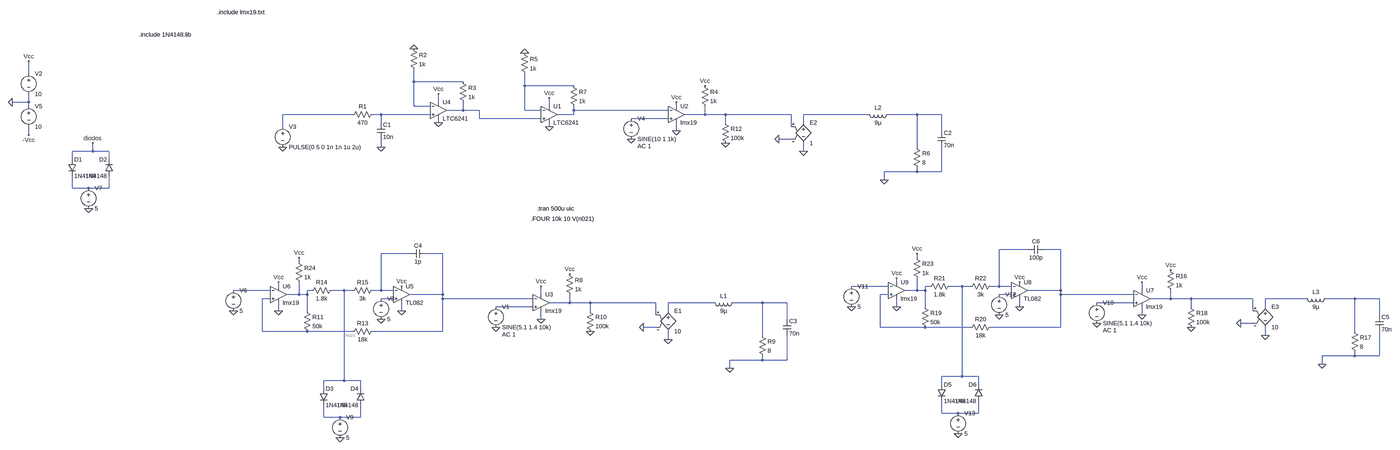
[diagram p0: schematic Entradas_varias_smith_Triger.asc, whole sheet]
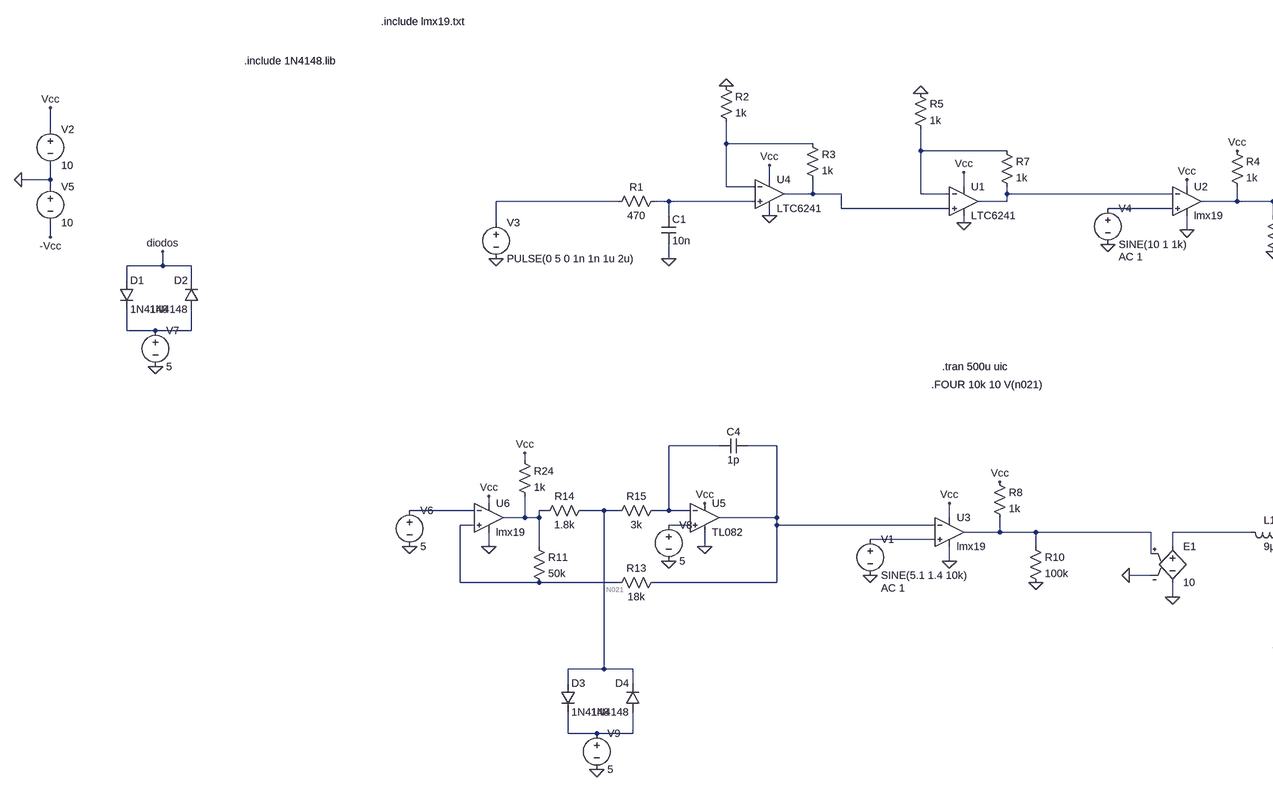
[diagram p1: schematic Entradas_varias_smith_Triger.asc, part, row 1 of 1, column 1 of 2]
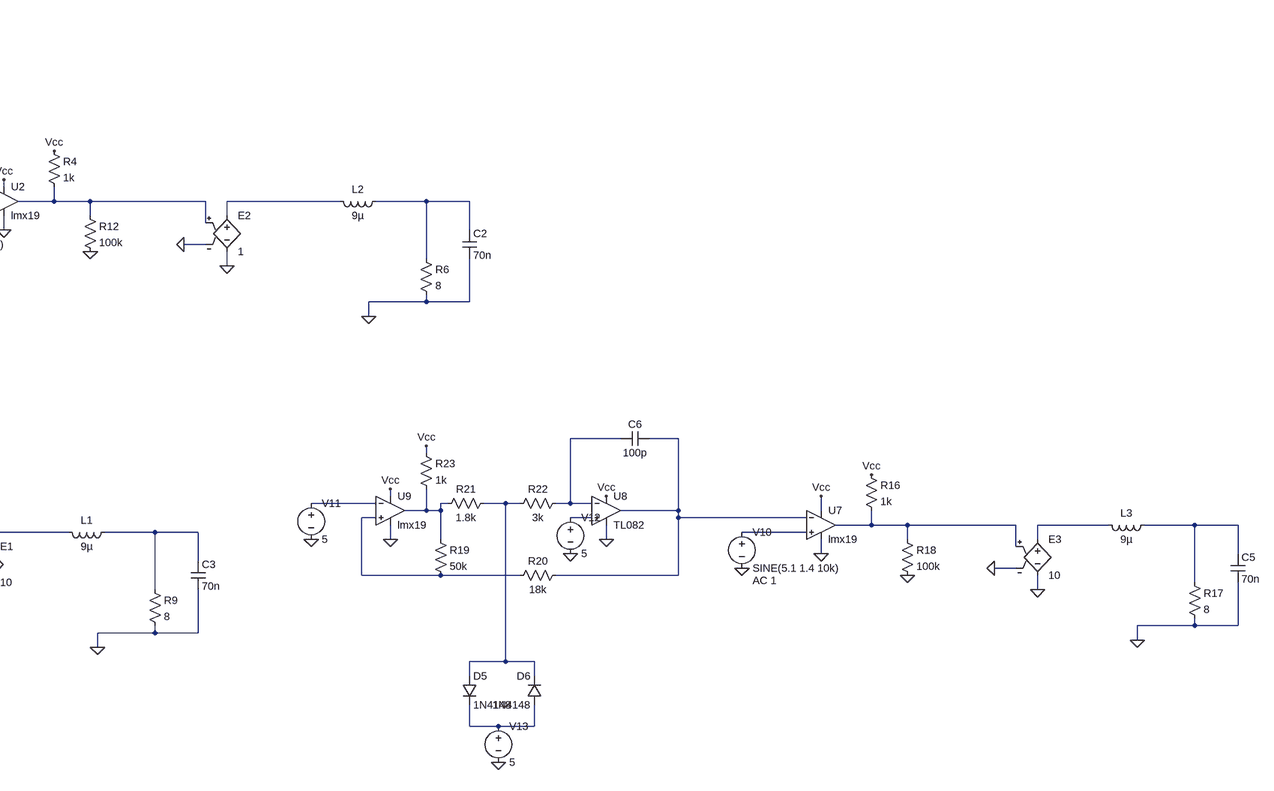
[diagram p2: schematic Entradas_varias_smith_Triger.asc, part, row 1 of 1, column 2 of 2]
Entradas_varias_smith_Triger.asc, the LTspice schematic file:
Version 4
SHEET 1 5240 2308
WIRE -544 176 -544 128
WIRE 1312 208 1312 160
WIRE 1504 208 1312 208
WIRE 1744 224 1744 176
WIRE 1936 224 1744 224
WIRE -544 288 -544 256
WIRE -544 288 -608 288
WIRE 1408 288 1408 256
WIRE -544 304 -544 288
WIRE 1312 304 1312 208
WIRE 1376 304 1312 304
WIRE 1840 304 1840 272
WIRE 2336 304 2336 288
WIRE 1504 320 1504 288
WIRE 1504 320 1440 320
WIRE 1568 320 1504 320
WIRE 1744 320 1744 224
WIRE 1808 320 1744 320
WIRE 1936 320 1936 304
WIRE 2304 320 1936 320
WIRE 1072 336 800 336
WIRE 1184 336 1152 336
WIRE 1376 336 1184 336
WIRE 1936 336 1936 320
WIRE 1936 336 1872 336
WIRE 2448 336 2448 304
WIRE 2448 336 2368 336
WIRE 2528 336 2448 336
WIRE 2784 336 2528 336
WIRE 3088 336 2832 336
WIRE 3280 336 3168 336
WIRE 3376 336 3280 336
WIRE 1568 352 1568 320
WIRE 1808 352 1568 352
WIRE 2304 352 2160 352
WIRE 1184 368 1184 336
WIRE 1408 368 1408 352
WIRE 2528 368 2528 336
WIRE 2832 368 2832 336
WIRE 800 384 800 336
WIRE 1840 384 1840 368
WIRE 2784 384 2784 336
WIRE 2336 400 2336 368
WIRE 3376 400 3376 336
WIRE -544 416 -544 384
WIRE 2784 432 2736 432
WIRE 1184 464 1184 432
WIRE 3280 464 3280 336
WIRE -176 480 -176 448
WIRE -176 480 -256 480
WIRE -112 480 -176 480
WIRE 2832 480 2832 448
WIRE -256 512 -256 480
WIRE -112 512 -112 480
WIRE 3280 560 3280 544
WIRE 3280 560 3152 560
WIRE 3376 560 3376 464
WIRE 3376 560 3280 560
WIRE 3152 592 3152 560
WIRE -256 624 -256 576
WIRE -192 624 -256 624
WIRE -112 624 -112 576
WIRE -112 624 -192 624
WIRE 3712 864 3600 864
WIRE 3840 864 3776 864
WIRE 1296 880 1184 880
WIRE 1424 880 1360 880
WIRE 3280 896 3280 880
WIRE 864 912 864 896
WIRE 3200 992 3200 976
WIRE 784 1008 784 992
WIRE 3168 1008 3024 1008
WIRE 3328 1008 3312 1008
WIRE 3456 1008 3408 1008
WIRE 3488 1008 3456 1008
WIRE 3600 1008 3600 864
WIRE 3600 1008 3568 1008
WIRE 3648 1008 3600 1008
WIRE 752 1024 608 1024
WIRE 912 1024 896 1024
WIRE 1040 1024 992 1024
WIRE 1072 1024 1040 1024
WIRE 1184 1024 1184 880
WIRE 1184 1024 1152 1024
WIRE 1232 1024 1184 1024
WIRE 3280 1024 3280 976
WIRE 3280 1024 3232 1024
WIRE 3312 1024 3312 1008
WIRE 3312 1024 3280 1024
WIRE 3840 1024 3840 864
WIRE 3840 1024 3712 1024
WIRE 4224 1024 4224 992
WIRE 864 1040 864 992
WIRE 864 1040 816 1040
WIRE 896 1040 896 1024
WIRE 896 1040 864 1040
WIRE 1424 1040 1424 880
WIRE 1424 1040 1296 1040
WIRE 1808 1040 1808 1008
WIRE 3168 1040 3136 1040
WIRE 3648 1040 3600 1040
WIRE 3840 1040 3840 1024
WIRE 4192 1040 3840 1040
WIRE 752 1056 720 1056
WIRE 1232 1056 1184 1056
WIRE 1424 1056 1424 1040
WIRE 1776 1056 1424 1056
WIRE 4336 1056 4336 1024
WIRE 4336 1056 4256 1056
WIRE 4416 1056 4336 1056
WIRE 4672 1056 4416 1056
WIRE 4896 1056 4720 1056
WIRE 5088 1056 4976 1056
WIRE 5184 1056 5088 1056
WIRE 1920 1072 1920 1040
WIRE 1920 1072 1840 1072
WIRE 2000 1072 1920 1072
WIRE 2256 1072 2000 1072
WIRE 2480 1072 2304 1072
WIRE 2672 1072 2560 1072
WIRE 2768 1072 2672 1072
WIRE 4192 1072 4048 1072
WIRE 1776 1088 1632 1088
WIRE 3200 1088 3200 1056
WIRE 3312 1088 3312 1024
WIRE 3680 1088 3680 1056
WIRE 4416 1088 4416 1056
WIRE 4720 1088 4720 1056
WIRE 784 1104 784 1072
WIRE 896 1104 896 1040
WIRE 1264 1104 1264 1072
WIRE 2000 1104 2000 1072
WIRE 2304 1104 2304 1072
WIRE 4672 1104 4672 1056
WIRE 2256 1120 2256 1072
WIRE 4224 1120 4224 1088
WIRE 5184 1120 5184 1056
WIRE 1808 1136 1808 1104
WIRE 2768 1136 2768 1072
WIRE 4672 1152 4624 1152
WIRE 2256 1168 2208 1168
WIRE 3136 1168 3136 1040
WIRE 3312 1168 3136 1168
WIRE 3488 1168 3312 1168
WIRE 3840 1168 3840 1040
WIRE 3840 1168 3568 1168
WIRE 720 1184 720 1056
WIRE 896 1184 720 1184
WIRE 1072 1184 896 1184
WIRE 1424 1184 1424 1056
WIRE 1424 1184 1152 1184
WIRE 5088 1184 5088 1056
WIRE 2672 1200 2672 1072
WIRE 4720 1200 4720 1168
WIRE 2304 1216 2304 1184
WIRE 5088 1280 5088 1264
WIRE 5088 1280 4960 1280
WIRE 5184 1280 5184 1184
WIRE 5184 1280 5088 1280
WIRE 2672 1296 2672 1280
WIRE 2672 1296 2544 1296
WIRE 2768 1296 2768 1200
WIRE 2768 1296 2672 1296
WIRE 4960 1312 4960 1280
WIRE 2544 1328 2544 1296
WIRE 3456 1360 3456 1008
WIRE 3456 1360 3376 1360
WIRE 3520 1360 3456 1360
WIRE 1040 1376 1040 1024
WIRE 1040 1376 960 1376
WIRE 1104 1376 1040 1376
WIRE 3376 1392 3376 1360
WIRE 3520 1392 3520 1360
WIRE 960 1408 960 1376
WIRE 1104 1408 1104 1376
WIRE 3376 1504 3376 1456
WIRE 3440 1504 3376 1504
WIRE 3520 1504 3520 1456
WIRE 3520 1504 3440 1504
WIRE 960 1520 960 1472
WIRE 1024 1520 960 1520
WIRE 1104 1520 1104 1472
WIRE 1104 1520 1024 1520
FLAG 800 464 0
FLAG 1184 464 0
FLAG 1312 80 0
FLAG 1408 368 0
FLAG 1408 256 Vcc
FLAG 2336 288 Vcc
FLAG 2160 432 0
FLAG 2448 224 Vcc
FLAG 3152 592 0
FLAG 2336 400 0
FLAG 1744 96 0
FLAG 1840 384 0
FLAG 1840 272 Vcc
FLAG -176 448 diodos
FLAG -608 288 0
FLAG -544 128 Vcc
FLAG -544 416 -Vcc
FLAG -192 704 0
FLAG 2528 448 0
FLAG 2832 480 0
FLAG 2736 432 0
FLAG 1632 1168 0
FLAG 1920 960 Vcc
FLAG 2544 1328 0
FLAG 1808 1136 0
FLAG 2000 1184 0
FLAG 2304 1216 0
FLAG 2208 1168 0
FLAG 784 992 Vcc
FLAG 1264 1008 Vcc
FLAG 608 1104 0
FLAG 1184 1136 0
FLAG 784 1104 0
FLAG 1264 1104 0
FLAG 864 896 Vcc
FLAG 1808 1008 Vcc
FLAG 1024 1600 0
FLAG 4048 1152 0
FLAG 4336 944 Vcc
FLAG 4960 1312 0
FLAG 4224 1120 0
FLAG 4416 1168 0
FLAG 4720 1200 0
FLAG 4624 1152 0
FLAG 3200 976 Vcc
FLAG 3680 992 Vcc
FLAG 3024 1088 0
FLAG 3600 1120 0
FLAG 3200 1088 0
FLAG 3680 1088 0
FLAG 3280 880 Vcc
FLAG 4224 992 Vcc
FLAG 3440 1584 0
SYMBOL voltage 800 368 R0
WINDOW 123 0 0 Left 2
WINDOW 39 0 0 Left 2
SYMATTR InstName V3
SYMATTR Value PULSE(0 5 0 1n 1n 1u 2u)
SYMBOL res 1168 320 R90
WINDOW 0 0 56 VBottom 2
WINDOW 3 32 56 VTop 2
SYMATTR InstName R1
SYMATTR Value 470
SYMBOL cap 1168 368 R0
SYMATTR InstName C1
SYMATTR Value 10n
SYMBOL res 1296 64 R0
SYMATTR InstName R2
SYMATTR Value 1k
SYMBOL res 1488 192 R0
SYMATTR InstName R3
SYMATTR Value 1k
SYMBOL Opamps\\opamp2 2336 272 R0
SYMATTR InstName U2
SYMATTR Value lmx19
SYMBOL voltage 2160 336 R0
WINDOW 123 24 124 Left 2
WINDOW 39 0 0 Left 2
SYMATTR Value2 AC 1
SYMATTR InstName V4
SYMATTR Value SINE(10 1 1k)
SYMBOL res 2432 208 R0
SYMATTR InstName R4
SYMATTR Value 1k
SYMBOL ind 3184 320 R90
WINDOW 0 5 56 VBottom 2
WINDOW 3 32 56 VTop 2
SYMATTR InstName L2
SYMATTR Value 9µ
SYMBOL res 3264 448 R0
SYMATTR InstName R6
SYMATTR Value 8
SYMBOL cap 3360 400 R0
SYMATTR InstName C2
SYMATTR Value 70n
SYMBOL Opamps\\LTC6241 1408 320 R0
SYMATTR InstName U4
SYMBOL res 1728 80 R0
SYMATTR InstName R5
SYMATTR Value 1k
SYMBOL res 1920 208 R0
SYMATTR InstName R7
SYMATTR Value 1k
SYMBOL Opamps\\LTC6241 1840 336 R0
SYMATTR InstName U1
SYMBOL diode -272 512 R0
SYMATTR InstName D1
SYMATTR Value 1N4148
SYMBOL diode -96 576 R180
WINDOW 0 24 64 Left 2
WINDOW 3 24 0 Left 2
SYMATTR InstName D2
SYMATTR Value 1N4148
SYMBOL voltage -544 160 R0
SYMATTR InstName V2
SYMATTR Value 10
SYMBOL voltage -544 288 R0
WINDOW 123 0 0 Left 2
WINDOW 39 0 0 Left 2
SYMATTR InstName V5
SYMATTR Value 10
SYMBOL voltage -192 608 R0
SYMATTR InstName V7
SYMATTR Value 5
SYMBOL res 2512 352 R0
SYMATTR InstName R12
SYMATTR Value 100k
SYMBOL e 2832 352 R0
SYMATTR InstName E2
SYMATTR Value 1
SYMBOL Opamps\\opamp2 1808 1008 R0
SYMATTR InstName U3
SYMATTR Value lmx19
SYMBOL voltage 1632 1072 R0
WINDOW 123 24 124 Left 2
WINDOW 39 0 0 Left 2
SYMATTR Value2 AC 1
SYMATTR InstName V1
SYMATTR Value SINE(5.1 1.4 10k)
SYMBOL res 1904 944 R0
SYMATTR InstName R8
SYMATTR Value 1k
SYMBOL ind 2576 1056 R90
WINDOW 0 5 56 VBottom 2
WINDOW 3 32 56 VTop 2
SYMATTR InstName L1
SYMATTR Value 9µ
SYMBOL res 2656 1184 R0
SYMATTR InstName R9
SYMATTR Value 8
SYMBOL cap 2752 1136 R0
SYMATTR InstName C3
SYMATTR Value 70n
SYMBOL res 1984 1088 R0
SYMATTR InstName R10
SYMATTR Value 100k
SYMBOL e 2304 1088 R0
SYMATTR InstName E1
SYMATTR Value 10
SYMBOL cap 1360 864 R90
WINDOW 0 0 32 VBottom 2
WINDOW 3 32 32 VTop 2
SYMATTR InstName C4
SYMATTR Value 1p
SYMBOL res 880 1088 R0
SYMATTR InstName R11
SYMATTR Value 50k
SYMBOL res 1168 1168 R90
WINDOW 0 0 56 VBottom 2
WINDOW 3 32 56 VTop 2
SYMATTR InstName R13
SYMATTR Value 18k
SYMBOL res 1008 1008 R90
WINDOW 0 0 56 VBottom 2
WINDOW 3 32 56 VTop 2
SYMATTR InstName R14
SYMATTR Value 1.8k
SYMBOL voltage 608 1008 R0
SYMATTR InstName V6
SYMATTR Value 5
SYMBOL voltage 1184 1040 R0
SYMATTR InstName V8
SYMATTR Value 5
SYMBOL TL082 1264 976 R0
SYMATTR InstName U5
SYMBOL res 1168 1008 R90
WINDOW 0 0 56 VBottom 2
WINDOW 3 32 56 VTop 2
SYMATTR InstName R15
SYMATTR Value 3k
SYMBOL Opamps\\opamp2 784 976 R0
SYMATTR InstName U6
SYMATTR Value lmx19
SYMBOL res 848 896 R0
SYMATTR InstName R24
SYMATTR Value 1k
SYMBOL diode 944 1408 R0
SYMATTR InstName D3
SYMATTR Value 1N4148
SYMBOL diode 1120 1472 R180
WINDOW 0 24 64 Left 2
WINDOW 3 24 0 Left 2
SYMATTR InstName D4
SYMATTR Value 1N4148
SYMBOL voltage 1024 1504 R0
SYMATTR InstName V9
SYMATTR Value 5
SYMBOL Opamps\\opamp2 4224 992 R0
SYMATTR InstName U7
SYMATTR Value lmx19
SYMBOL voltage 4048 1056 R0
WINDOW 123 24 124 Left 2
WINDOW 39 0 0 Left 2
SYMATTR Value2 AC 1
SYMATTR InstName V10
SYMATTR Value SINE(5.1 1.4 10k)
SYMBOL res 4320 928 R0
SYMATTR InstName R16
SYMATTR Value 1k
SYMBOL ind 4992 1040 R90
WINDOW 0 5 56 VBottom 2
WINDOW 3 32 56 VTop 2
SYMATTR InstName L3
SYMATTR Value 9µ
SYMBOL res 5072 1168 R0
SYMATTR InstName R17
SYMATTR Value 8
SYMBOL cap 5168 1120 R0
SYMATTR InstName C5
SYMATTR Value 70n
SYMBOL res 4400 1072 R0
SYMATTR InstName R18
SYMATTR Value 100k
SYMBOL e 4720 1072 R0
SYMATTR InstName E3
SYMATTR Value 10
SYMBOL cap 3776 848 R90
WINDOW 0 0 32 VBottom 2
WINDOW 3 32 32 VTop 2
SYMATTR InstName C6
SYMATTR Value 100p
SYMBOL res 3296 1072 R0
SYMATTR InstName R19
SYMATTR Value 50k
SYMBOL res 3584 1152 R90
WINDOW 0 0 56 VBottom 2
WINDOW 3 32 56 VTop 2
SYMATTR InstName R20
SYMATTR Value 18k
SYMBOL res 3424 992 R90
WINDOW 0 0 56 VBottom 2
WINDOW 3 32 56 VTop 2
SYMATTR InstName R21
SYMATTR Value 1.8k
SYMBOL voltage 3024 992 R0
SYMATTR InstName V11
SYMATTR Value 5
SYMBOL voltage 3600 1024 R0
SYMATTR InstName V12
SYMATTR Value 5
SYMBOL TL082 3680 960 R0
SYMATTR InstName U8
SYMBOL res 3584 992 R90
WINDOW 0 0 56 VBottom 2
WINDOW 3 32 56 VTop 2
SYMATTR InstName R22
SYMATTR Value 3k
SYMBOL Opamps\\opamp2 3200 960 R0
SYMATTR InstName U9
SYMATTR Value lmx19
SYMBOL res 3264 880 R0
SYMATTR InstName R23
SYMATTR Value 1k
SYMBOL diode 3360 1392 R0
SYMATTR InstName D5
SYMATTR Value 1N4148
SYMBOL diode 3536 1456 R180
WINDOW 0 24 64 Left 2
WINDOW 3 24 0 Left 2
SYMATTR InstName D6
SYMATTR Value 1N4148
SYMBOL voltage 3440 1488 R0
SYMATTR InstName V13
SYMATTR Value 5
TEXT 544 -64 Left 2 !.include lmx19.txt
TEXT 1792 704 Left 2 !.tran 500u uic
TEXT 1768 744 Left 2 !.FOUR 10k 10 V(n021)
TEXT 152 24 Left 2 !.include 1N4148.lib

The netlist it stands for:
* Entradas_varias_smith_Triger.asc
V3 N005 0 PULSE(0 5 0 1n 1n 1u 2u)
R1 N006 N005 470
C1 N006 0 10n
R2 0 N001 1k
R3 N001 N003 1k
XU2 N010 N004 Vcc 0 N007 lmx19  ; pins In+ In- V+ V- OUT
V4 N010 0 SINE(10 1 1k) AC 1
R4 Vcc N007 1k
L2 N009 N008 9µ
R6 N009 0 8
C2 N009 0 70n
XU4 N006 N001 Vcc 0 N003 LTC6241  ; pins In+ In- V+ V- OUT
R5 0 N002 1k
R7 N002 N004 1k
XU1 N003 N002 Vcc 0 N004 LTC6241  ; pins In+ In- V+ V- OUT
D1 diodos N011 1N4148
D2 N011 diodos 1N4148
V2 Vcc 0 10
V5 0 -Vcc 10
V7 N011 0 5
R12 N007 0 100k
E2 N008 0 N007 0 1
XU3 N033 N015 Vcc 0 N029 lmx19  ; pins In+ In- V+ V- OUT
V1 N033 0 SINE(5.1 1.4 10k) AC 1
R8 Vcc N029 1k
L1 N031 N030 9µ
R9 N031 0 8
C3 N031 0 70n
R10 N029 0 100k
E1 N030 0 N029 0 10
C4 N015 N014 1p
R11 N020 N024 50k
R13 N015 N024 18k
R14 N021 N020 1.8k
V6 N019 0 5
V8 N025 0 5
* U5: TL082 (symbol TL082 not available, pins judged from their places): In+=N025 In-=N014 V+=Vcc V-=0 OUT=N015
R15 N014 N021 3k
XU6 N024 N019 Vcc 0 N020 lmx19  ; pins In+ In- V+ V- OUT
R24 Vcc N020 1k
D3 N021 N035 1N4148
D4 N035 N021 1N4148
V9 N035 0 5
XU7 N032 N013 Vcc 0 N026 lmx19  ; pins In+ In- V+ V- OUT
V10 N032 0 SINE(5.1 1.4 10k) AC 1
R16 Vcc N026 1k
L3 N028 N027 9µ
R17 N028 0 8
C5 N028 0 70n
R18 N026 0 100k
E3 N027 0 N026 0 10
C6 N013 N012 100p
R19 N017 N022 50k
R20 N013 N022 18k
R21 N018 N017 1.8k
V11 N016 0 5
V12 N023 0 5
* U8: TL082 (symbol TL082 not available, pins judged from their places): In+=N023 In-=N012 V+=Vcc V-=0 OUT=N013
R22 N012 N018 3k
XU9 N022 N016 Vcc 0 N017 lmx19  ; pins In+ In- V+ V- OUT
R23 Vcc N017 1k
D5 N018 N034 1N4148
D6 N034 N018 1N4148
V13 N034 0 5
.model D D
.lib standard.dio
.include lmx19.txt
.tran 500u uic
.FOUR 10k 10 V(n021)
.include 1N4148.lib
.lib LTC4.lib
.backanno
.end